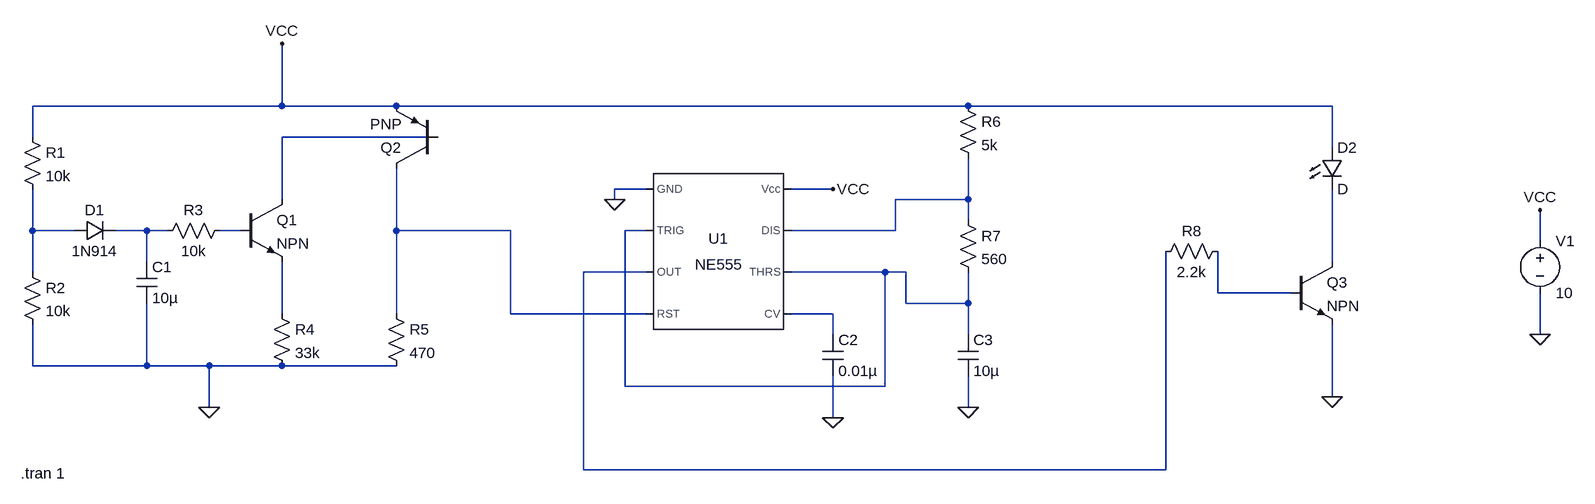
[diagram p0: schematic fire_alarm.asc]
fire_alarm.asc, the LTspice schematic file:
Version 4
SHEET 1 1816 680
WIRE -176 -144 -176 -240
WIRE -176 -144 -560 -144
WIRE 0 -144 -176 -144
WIRE 880 -144 0 -144
WIRE 1440 -144 880 -144
WIRE -560 -96 -560 -144
WIRE 64 -96 -176 -96
WIRE 1440 -80 1440 -144
WIRE 384 -16 336 -16
WIRE 672 -16 608 -16
WIRE -176 0 -176 -96
WIRE 336 0 336 -16
WIRE 880 0 880 -64
WIRE 880 0 768 0
WIRE 880 32 880 0
WIRE -560 48 -560 -16
WIRE -496 48 -560 48
WIRE -384 48 -432 48
WIRE -352 48 -384 48
WIRE -240 48 -272 48
WIRE 0 48 0 -48
WIRE 176 48 0 48
WIRE 384 48 352 48
WIRE 768 48 768 0
WIRE 768 48 608 48
WIRE 1760 64 1760 16
WIRE -384 96 -384 48
WIRE 1440 96 1440 -16
WIRE -560 112 -560 48
WIRE 384 112 288 112
WIRE 752 112 608 112
WIRE 784 112 752 112
WIRE 1264 144 1264 80
WIRE 1376 144 1264 144
WIRE 784 160 784 112
WIRE 880 160 880 112
WIRE 880 160 784 160
WIRE -176 176 -176 96
WIRE 0 176 0 48
WIRE 176 176 176 48
WIRE 384 176 176 176
WIRE 672 176 608 176
WIRE 672 208 672 176
WIRE 880 208 880 160
WIRE 1760 208 1760 144
WIRE -560 256 -560 192
WIRE -384 256 -384 160
WIRE -384 256 -560 256
WIRE -288 256 -384 256
WIRE -176 256 -288 256
WIRE 0 256 -176 256
WIRE 352 288 352 48
WIRE 752 288 752 112
WIRE 752 288 352 288
WIRE 1440 304 1440 192
WIRE -288 320 -288 256
WIRE 880 320 880 272
WIRE 672 336 672 272
WIRE 288 416 288 112
WIRE 1184 416 1184 80
WIRE 1184 416 288 416
FLAG 1760 208 0
FLAG 1760 16 VCC
FLAG -176 -240 VCC
FLAG 672 336 0
FLAG 336 0 0
FLAG -288 320 0
FLAG 672 -16 VCC
FLAG 880 320 0
FLAG 1440 304 0
SYMBOL Misc\\NE555 496 80 R0
SYMATTR InstName U1
SYMBOL res -576 -112 R0
SYMATTR InstName R1
SYMATTR Value 10k
SYMBOL res -576 96 R0
SYMATTR InstName R2
SYMATTR Value 10k
SYMBOL diode -496 64 R270
WINDOW 0 32 32 VTop 2
WINDOW 3 0 32 VBottom 2
SYMATTR InstName D1
SYMATTR Value 1N914
SYMBOL cap -400 96 R0
SYMATTR InstName C1
SYMATTR Value 10µ
SYMBOL res -256 32 R90
WINDOW 0 0 56 VBottom 2
WINDOW 3 32 56 VTop 2
SYMATTR InstName R3
SYMATTR Value 10k
SYMBOL npn -240 0 R0
SYMATTR InstName Q1
SYMBOL res -192 160 R0
SYMATTR InstName R4
SYMATTR Value 33k
SYMBOL res -16 160 R0
SYMATTR InstName R5
SYMATTR Value 470
SYMBOL voltage 1760 48 R0
WINDOW 123 0 0 Left 0
WINDOW 39 0 0 Left 0
SYMATTR InstName V1
SYMATTR Value 10
SYMBOL cap 656 208 R0
SYMATTR InstName C2
SYMATTR Value 0.01µ
SYMBOL res 864 -160 R0
SYMATTR InstName R6
SYMATTR Value 5k
SYMBOL res 864 16 R0
SYMATTR InstName R7
SYMATTR Value 560
SYMBOL cap 864 208 R0
SYMATTR InstName C3
SYMATTR Value 10µ
SYMBOL res 1280 64 R90
WINDOW 0 0 56 VBottom 2
WINDOW 3 32 56 VTop 2
SYMATTR InstName R8
SYMATTR Value 2.2k
SYMBOL npn 1376 96 R0
SYMATTR InstName Q3
SYMBOL LED 1424 -80 R0
SYMATTR InstName D2
SYMBOL pnp 64 -48 R180
SYMATTR InstName Q2
TEXT -578 422 Left 2 !.tran 1

The netlist it stands for:
* fire_alarm.asc
XU1 0 N007 N009 N006 N012 N007 N002 VCC NE555  ; pins GND TRIG OUT RST CV THRS DIS Vcc
R1 VCC N003 10k
R2 N003 0 10k
D1 N003 N004 1N914
C1 N004 0 10µ
R3 N005 N004 10k
Q1 N001 N005 N011 0 NPN
R4 N011 0 33k
R5 N006 0 470
V1 VCC 0 10
C2 N012 0 0.01µ
R6 VCC N002 5k
R7 N002 N007 560
C3 N007 0 10µ
R8 N010 N009 2.2k
Q3 N008 N010 0 0 NPN
D2 VCC N008 D
Q2 N006 N001 VCC 0 PNP
.model D D
.lib standard.dio
.model NPN NPN
.model PNP PNP
.lib standard.bjt
.tran 1
.lib NE555.sub
.backanno
.end